# EAGLE schematic sensor_to_raspi (EAGLE 9.5.2)
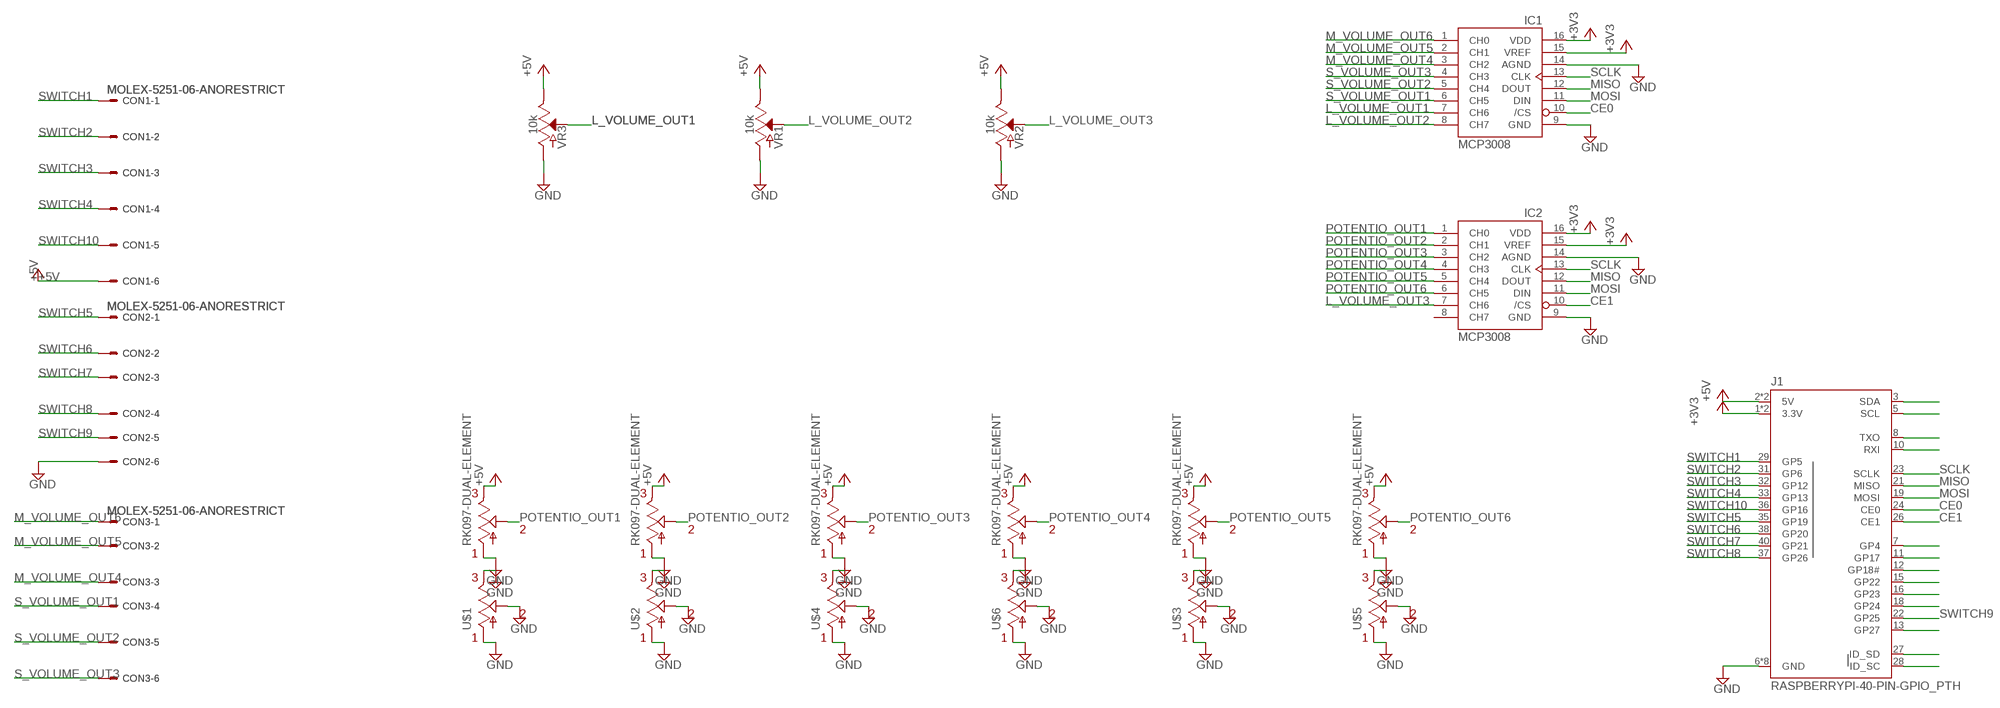
[diagram p0: schematic, sheet 1]

## Parts
CON1  MOLEX-5251-06-ANORESTRICT  [5251-06-ANORESTRICT]
CON2  MOLEX-5251-06-ANORESTRICT  [5251-06-ANORESTRICT]
CON3  MOLEX-5251-06-ANORESTRICT  [5251-06-ANORESTRICT]
IC1  MCP3008  [DIL16]
IC2  MCP3008  [DIL16]
J1  RASPBERRYPI-40-PIN-GPIO_PTH  [2X20_SHROUDED]
U$1  RK097-DUAL-ELEMENT  [RK097-DUAL-ELEMENT]
U$2  RK097-DUAL-ELEMENT  [RK097-DUAL-ELEMENT]
U$3  RK097-DUAL-ELEMENT  [RK097-DUAL-ELEMENT]
U$4  RK097-DUAL-ELEMENT  [RK097-DUAL-ELEMENT]
U$5  RK097-DUAL-ELEMENT  [RK097-DUAL-ELEMENT]
U$6  RK097-DUAL-ELEMENT  [RK097-DUAL-ELEMENT]
VR1  10k  POTENTIOMETER_SLIDE-60MM-1/2W-20%  [SLIDER-XLARGE]
VR2  10k  POTENTIOMETER_SLIDE-60MM-1/2W-20%  [SLIDER-XLARGE]
VR3  10k  POTENTIOMETER_SLIDE-60MM-1/2W-20%  [SLIDER-XLARGE]

## Nets
+3V3: IC1.15(VREF) IC1.16(VDD) IC2.15(VREF) IC2.16(VDD) J1.1(3.3V) J1.17(3.3V)
+5V: CON1.6 J1.2(5V) J1.4(5V) U$1.P$3(E) U$2.P$3(E) U$3.P$3(E) U$4.P$3(E) U$5.P$3(E) U$6.P$3(E) VR1.1(E) VR2.1(E) VR3.1(E)
CE0: IC1.10(/CS) J1.24(CE0)
CE1: IC2.10(/CS) J1.26(CE1)
GND: CON2.6 IC1.9(GND) IC1.14(AGND) IC2.9(GND) IC2.14(AGND) J1.6(GND) J1.9(GND) J1.14(GND) J1.20(GND) J1.25(GND) J1.30(GND) J1.34(GND) J1.39(GND) U$1.P$1(A) U$1.P$2(A1) U$1.P$4(E1) U$1.P$6(S1) U$2.P$1(A) U$2.P$2(A1) U$2.P$4(E1) U$2.P$6(S1) U$3.P$1(A) U$3.P$2(A1) U$3.P$4(E1) U$3.P$6(S1) U$4.P$1(A) U$4.P$2(A1) U$4.P$4(E1) U$4.P$6(S1) U$5.P$1(A) U$5.P$2(A1) U$5.P$4(E1) U$5.P$6(S1) U$6.P$1(A) U$6.P$2(A1) U$6.P$4(E1) U$6.P$6(S1) VR1.3(A) VR2.3(A) VR3.3(A)
L_VOLUME_OUT1: IC1.7(CH6) VR3.2A(S)
L_VOLUME_OUT2: IC1.8(CH7) VR1.2A(S)
L_VOLUME_OUT3: IC2.7(CH6) VR2.2A(S)
M_VOLUME_OUT4: CON3.3 IC1.3(CH2)
M_VOLUME_OUT5: CON3.2 IC1.2(CH1)
M_VOLUME_OUT6: CON3.1 IC1.1(CH0)
MISO: IC1.12(DOUT) IC2.12(DOUT) J1.21(MISO)
MOSI: IC1.11(DIN) IC2.11(DIN) J1.19(MOSI)
N$13: J1.3(SDA)
N$14: J1.5(SCL)
N$15: J1.8(TXO)
N$16: J1.10(RXI)
N$22: J1.7(GP4)
N$23: J1.11(GP17)
N$24: J1.12(GP18#)
N$25: J1.15(GP22)
N$26: J1.16(GP23)
N$27: J1.18(GP24)
N$29: J1.13(GP27)
N$38: J1.27(ID_SD)
N$39: J1.28(ID_SC)
POTENTIO_OUT1: IC2.1(CH0) U$1.P$5(S)
POTENTIO_OUT2: IC2.2(CH1) U$2.P$5(S)
POTENTIO_OUT3: IC2.3(CH2) U$4.P$5(S)
POTENTIO_OUT4: IC2.4(CH3) U$6.P$5(S)
POTENTIO_OUT5: IC2.5(CH4) U$3.P$5(S)
POTENTIO_OUT6: IC2.6(CH5) U$5.P$5(S)
S_VOLUME_OUT1: CON3.4 IC1.6(CH5)
S_VOLUME_OUT2: CON3.5 IC1.5(CH4)
S_VOLUME_OUT3: CON3.6 IC1.4(CH3)
SCLK: IC1.13(CLK) IC2.13(CLK) J1.23(SCLK)
SWITCH1: CON1.1 J1.29(GP5)
SWITCH2: CON1.2 J1.31(GP6)
SWITCH3: CON1.3 J1.32(GP12)
SWITCH4: CON1.4 J1.33(GP13)
SWITCH5: CON2.1 J1.35(GP19)
SWITCH6: CON2.2 J1.38(GP20)
SWITCH7: CON2.3 J1.40(GP21)
SWITCH8: CON2.4 J1.37(GP26)
SWITCH9: CON2.5 J1.22(GP25)
SWITCH10: CON1.5 J1.36(GP16)
Unconnected: IC2.8(CH7)

## Library data of the parts
CON1-CON3 = Connector_Robotech:MOLEX-5251-06: CONNECTOR Molex 5251 6-pin wire to board 2.54 mm (.1 inch) pitch header
IC1 IC2 = adafruit:MCP3008
J1 = SparkFun-Connectors:RASPBERRYPI-40-PIN-GPIO: Raspberry Pi GPIO Header 2x20 pin connector, as found on B, B+, A+ models. Both shrouded PTH and SMT versions available. SparkFun Products: GPIO Shrouded Header <https://www.sparkfun.com/products/13054>- PTH SparkFun Pi Wedge (Preassembled) <https://www.sparkfun.com/products/13717>; PROD_ID: CONN-12263; SF_ID: PRT-13054
U$1-U$6 = alps_japan_potentiometers:RK097-DUAL-ELEMENT: SCHEMATIC FOR DUAL POTENTIOMETER
VR1-VR3 = SparkFun-Resistors:POTENTIOMETER_SLIDE: Slide Potentiometer Slide-type potentiometers - pots that are adjusted by sliding a wiper up or down. Commonly found en-masse on sound boards. Variants 60MM - Slide Pot - X-Large (10k Linear Taper) <https://www.sparkfun.com/products/9119> (COM-09119) 10k linear slide pot with 60mm travel. Datasheet <http://cdn.sparkfun.com/datasheets/Components/Switches/SC608N-b10k.pdf> 30MM, 30MM-KIT - Slide Pot - Medium (10k Linear Taper) <https://www.sparkfun.com/products/11621> (COM-11621) 10k linear slide pot with 30mm travel. Datasheet <http://cdn.sparkfun.com/datasheets/Components/Switches/C-31-.pdf> (C3031N-1A2-B10K-GP) "KIT" variant, intended for soldering kits, has tStop removed from pads so the component can only be stuffed on one side of the board. 20MM - Slide Pot - Small (10k Linear Taper) <https://www.sparkfun.com/products/11620> (COM-11620) 10k linear slide pot with 20mm travel. Datasheet <http://cdn.sparkfun.com/datasheets/Components/Switches/C-31-.pdf> (C2031N-1A2-B10K-GP); PROD_ID: RES-09484; SF_SKU: COM-09119